# Altium schematic sheet JC1001-1.SchDoc
size A4
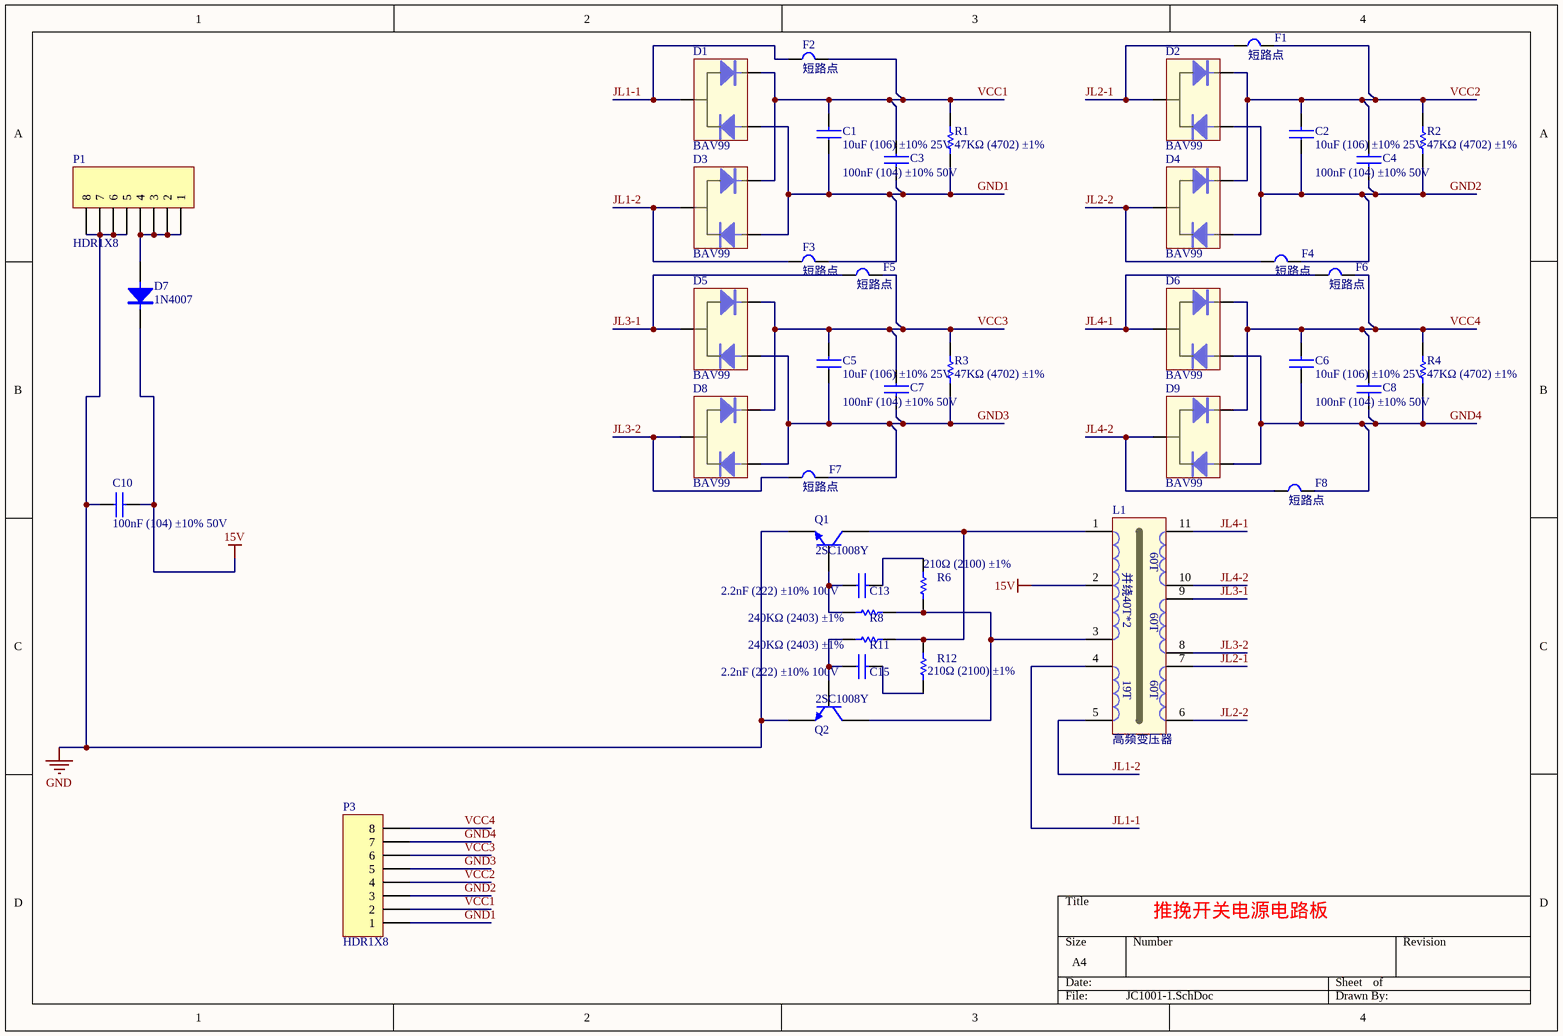
[diagram p0: JC1001-1.SchDoc]

## Parts
C1  10uF (106) ±10% 25V  [C0805]
C2  10uF (106) ±10% 25V  [C0805]
C3  100nF (104) ±10% 50V  [C0805]
C4  100nF (104) ±10% 50V  [C0805]
C5  10uF (106) ±10% 25V  [C0805]
C6  10uF (106) ±10% 25V  [C0805]
C7  100nF (104) ±10% 50V  [C0805]
C8  100nF (104) ±10% 50V  [C0805]
C10  100nF (104) ±10% 50V  [C0805]
C13  2.2nF (222) ±10% 100V  [C0805]
C15  2.2nF (222) ±10% 100V  [C0805]
D1  BAV99  [SOT-23-3L]
D2  BAV99  [SOT-23-3L]
D3  BAV99  [SOT-23-3L]
D4  BAV99  [SOT-23-3L]
D5  BAV99  [SOT-23-3L]
D6  BAV99  [SOT-23-3L]
D7  1N4007  [SMA]
D8  BAV99  [SOT-23-3L]
D9  BAV99  [SOT-23-3L]
F1  短路点  [SCP-2]
F2  短路点  [SCP-2]
F3  短路点  [SCP-2]
F4  短路点  [SCP-2]
F5  短路点  [SCP-2]
F6  短路点  [SCP-2]
F7  短路点  [SCP-2]
F8  短路点  [SCP-2]
L1  高频变压器  [EPC13-11]
P1  HDR1X8  [HDR1X8]
P3  HDR1X8  [HDR1X8]
Q1  2SC1008Y  [TO-92-3]
Q2  2SC1008Y  [TO-92-3]
R1  47KΩ (4702) ±1%  [R0805]
R2  47KΩ (4702) ±1%  [R0805]
R3  47KΩ (4702) ±1%  [R0805]
R4  47KΩ (4702) ±1%  [R0805]
R6  210Ω (2100) ±1%  [R0805]
R8  240KΩ (2403) ±1%  [R0805]
R11  240KΩ (2403) ±1%  [R0805]
R12  210Ω (2100) ±1%  [R0805]

## Nets
15V: C10.2 D7.2(K) L1.2
GND: C10.1 P1.5 P1.6 P1.7 P1.8 Q1.1(E) Q2.1(E)
GND1: C1.1 C3.2 D1.1 D3.1 F3.2 P3.1 R1.1
GND2: C2.1 C4.2 D2.1 D4.1 F4.2 P3.3 R2.1
GND3: C5.1 C7.2 D5.1 D8.1 F7.2 P3.5 R3.1
GND4: C6.1 C8.2 D6.1 D9.1 F8.2 P3.7 R4.1
JL1-1: D1.3 F2.1 L1.4
JL1-2: D3.3 F3.1 L1.5
JL2-1: D2.3 F1.1 L1.7
JL2-2: D4.3 F4.1 L1.6
JL3-1: D5.3 F5.1 L1.9
JL3-2: D8.3 F7.1 L1.8
JL4-1: D6.3 F6.1 L1.11
JL4-2: D9.3 F8.1 L1.10
VCC1: C1.2 C3.1 D1.2 D3.2 F2.2 P3.2 R1.2
VCC2: C2.2 C4.1 D2.2 D4.2 F1.2 P3.4 R2.2
VCC3: C5.2 C7.1 D5.2 D8.2 F5.2 P3.6 R3.2
VCC4: C6.2 C8.1 D6.2 D9.2 F6.2 P3.8 R4.2
NetC13_1: C13.1 Q1.2(B) R8.2
NetC13_2: C13.2 R6.2
NetC15_1: C15.1 Q2.2(B) R11.2
NetC15_2: C15.2 R12.1
NetD7_1: D7.1(A) P1.1 P1.2 P1.3 P1.4
NetL1_1: L1.1 Q1.3(C) R11.1 R12.2
NetL1_3: L1.3 Q2.3(C) R6.1 R8.1

## Notes on the sheet
- 推挽开关电源电路板
- (in symbol L直插变压器(EPC13-11) EPC13-15-5-20*3) 60T; 并绕40T*2; 19T

## Library data of the parts
C1 C2 C5 C6 = C贴片电容(C0805) 10uF (106) ±10% 25V: 0805X106K250NT
C3 C4 C7 C8 C10 = C贴片电容(C0805) 100nF (104) ±10% 50V: CL21B104KBCNNNC
C13 C15 = C贴片电容(C0805) 2.2nF (222) ±10% 100V: CL21B222KCANNNC
D1-D6 D8 D9 = D贴片开关二极管(SOT-23-3L) BAV99
D7 = D贴片整流管(SMA) 1N4007: M7
F1-F8 = F贴片跳线开关(SCP-2) 半圆短路点: 半圆短路点
L1 = L直插变压器(EPC13-11) EPC13-15-5-20*3: EPC13-15-5-20*3
P1 P3 = P标准插针2.54间距(HDR?*?)  HDR1X8
Q1 Q2 = Q直插三极管(TO-92-3) 2SC1008Y NPN
R1-R4 = R贴片电阻(R0805) 47KΩ (4702) ±1%: 0805W8F4702T5E
R6 R12 = R贴片电阻(R0805) 210Ω (2100) ±1%: 0805W8F2100T5E
R8 R11 = R贴片电阻(R0805) 240KΩ (2403) ±1%: 0805W8F2403T5E